# Altium schematic sheet Microphone-Boards_V1.0_SD18OB261.SchDoc: Microphone-Boards
size A4; PageSetup: Record=PageOptions|CenterHorizontal=True|CenterVertical=True|PrintScale=0.97|XCorrection=1.00|YCorrection=1.00|PrintKind=0|BorderSize=5000000|LeftOffset=0|BottomOffset=0|Orientation=2|PaperLength=1000|PaperWidth=1000|Scale=100|PaperSource=7|PrintQuality=-3|MediaType=1|DitherType=10|PrintScaleMode=1|PaperKind=A4|PaperIndex=9; Organization: Ostschweizer Fachhochschule; Address2: Florian Baumgartner & Alain Keller; Address3: florian.baumgartner@ost.ch; DocumentNumber: 1; Revision: V1.0; SheetNumber: 5; SheetTotal: 5; Author: Florian Baumgartner & Alain Keller; Subtitle: SD18OB261-060 (Bottom Port)
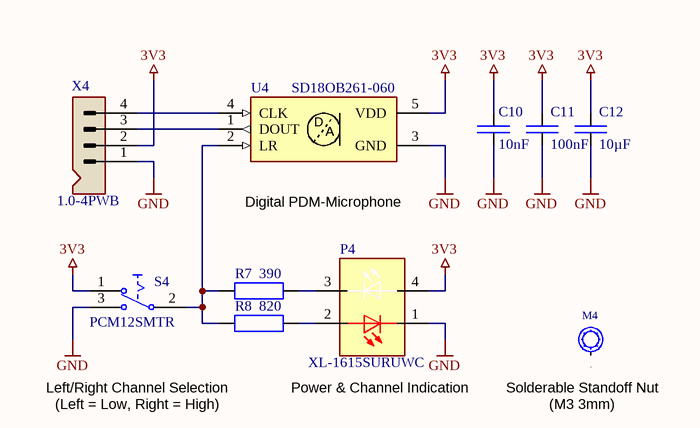
[diagram p0: Microphone-Boards_V1.0_SD18OB261.SchDoc]

## Parts
C10  10nF  [SMD Keramikkondensator 0603]
C11  100nF  [SMD Keramikkondensator 0603]
C12  10µF  [SMD Keramikkondensator 1206]
M4  SMTSO-M3-3ET  [SMD Solder-Nut (M3 3mm)]  (value not drawn)
P4  XL-1615SURUWC  [SMD LED 0606]
R7  390  [SMD Widerstand 0603]
R8  820  [SMD Widerstand 0603]
S4  PCM12SMTR  [SMD Switch SPDT (PCM12SMTR)]
U4  SD18OB261-060  [SMD Microphone (SD18OB261-060)]
X4  1.0-4PWB  [SMD Connector (SM04B-SRSS-TB)]

## Ports
M

## Nets
3V3: C10.2 C11.2 C12.2 P4.4(WA) S4.1(NC1) U4.5(VDD) X4.2
GND: C10.1 C11.1 C12.1 P4.1(RC) S4.3(NO1) U4.3(GND) X4.1
M: M4.1 ; port M
NetP4_2: P4.2(RA) R8.2
NetP4_3: P4.3(WC) R7.2
NetR7_1: R7.1 R8.1 S4.2(COMMON1) U4.2(LR)
NetU4_1: U4.1(DOUT) X4.3
NetU4_4: U4.4(CLK) X4.4

## Notes on the sheet
- (near U4) Digital PDM-Microphone
- Left/Right Channel Selection
- Power & Channel Indication
- (near M4) Solderable Standoff Nut
- (Left = Low, Right = High)
- (near M4) (M3 3mm)
- Title
- Author:
- Subtitle
- Date:
- Rev:
- File:
- Sheet
- of
- (in symbol U-SD18OB261-060) D; A

## Library data of the parts
C10 = C-CAPACITOR: CAP-MK; Component Description: Multilayer Ceramic Capacitors; Component Value: 10nF 50V; Digikey: 445-5662-1-ND; Farnell: 2346966; Mouser: 77-VJ0603V103ZXAPBC; JLC-Parts: C57112; Unit Price: 0.01
C11 = E6 - 100nF: SMD Ceramic Capacitor E6; Component Value: 100nF 50V; Component Description: Multilayer Ceramic Capacitors MLCC; ComponentLink1Description: Datasheet; ComponentLink1URL: https://datasheet.lcsc.com/lcsc/1809301912_YAGEO-CC0603KRX7R9BB104_C14663.pdf; Digikey: 445-6899-1-ND; Farnell: 2210822; JLC-Parts: C14663; Mouser: 810-CGA2B3X7R1H104K; Unit Price: 0.01
C12 = E6 - 10uF: SMD Ceramic Capacitor E6; Component Value: 10µF 50V; Component Description: Multilayer Ceramic Capacitors MLCC; ComponentLink1Description: Datasheet; ComponentLink1URL: https://datasheet.lcsc.com/lcsc/1810191219_Samsung-Electro-Mechanics-CL10A106KP8NNNC_C19702.pdf; Digikey: 587-3258-1-ND; Farnell: 2113070; JLC-Parts: C13585; Mouser: 963-LMK107BBJ106MALT; Unit Price: 0.01
M4 = M-Spacer_M3_3mm: Solderable Standoff Nut; Component Value: M3 3mm; Mouser: 153-SMTSO-M3-3ET; Component Description: Solderable Standoff Nut; Unit Price: 0.05; JLC-Parts: C2915308; ComponentLink1Description: Datasheet; ComponentLink1URL: https://datasheet.lcsc.com/lcsc/2112061830_Sinhoo-SMTSO3030CTJ_C2915308.pdf
P4 = P-XL-1615SURUWC: LED Red/White; ComponentLink1Description: Datasheet; ComponentLink1URL: https://datasheet.lcsc.com/lcsc/2211030000_XINGLIGHT-XL-1615SURUWC_C965837.pdf; JLC-Parts: C965837; Component Description: LED Red/White; Component Value: XL-1615SURUWC; Unit Price: 0.02
R7 = R-RESISTOR: SMD-Widerstand 1/4W; Component Description: Thick Film Chip Resistor; Component Value: 390 (75V, 100mW, 1%); Digikey: P390HCT-ND; Farnell: 2303111; Mouser: 667-ERJ-3EKF3900V; JLC-Parts: C23151; Unit Price: 0.06
R8 = R-RESISTOR: SMD-Widerstand 1/4W; Component Description: Thick Film Chip Resistor; Component Value: 820 (75V, 100mW, 1%); Digikey: P820HCT-ND; Farnell: 2303136; Mouser: 667-ERJ-3EKF8200V; JLC-Parts: C23253; Unit Price: 0.06
S4 = S-PCM12SMTR: Miniature Slide Switch; aliExpress: 33002042977; Component Value: PCM12SMTR (SPDT); Digikey: 401-2016-1-ND; Mouser: 611-PCM12SMTR; Farnell: 9575146; ComponentLink1Description: Datasheet; ComponentLink1URL: https://datasheet.lcsc.com/lcsc/1912111437_SHOU-HAN-MSK12C02_C431540.pdf; JLC-Parts: C431540; Component Description: Miniature Slide Switch; Unit Price: 0.04
U4 = U-SD18OB261-060: Digital PDM MEMS Microphone (Bottom Port); Digikey: 4719-SD18OB261-050DKR-ND; ComponentLink1Description: Datasheet; ComponentLink1URL: https://datasheet.lcsc.com/lcsc/2208241200_Goertek-SD18OB261-060_C2895290.pdf; Component Description: Digital PDM MEMS Microphone (Bottom Port); Component Value: SD18OB261-060; JLC-Parts: C2895290; Unit Price: 0.61
X4 = X-Stiftleiste (4-Fach): Wire To Board Connector (1x4P 1.0mm); Digikey: 455-SM04B-SRSS-TBCT-ND; Farnell: 1830839; Component Description: Wire To Board Connector (1x4P 1.0mm); Component Value: 1.0-4PWB; JLC-Parts: C2905006; Unit Price: 0.03; ComponentLink1Description: Datasheet; ComponentLink1URL: https://datasheet.lcsc.com/lcsc/2111080930_DEALON-1-0-4PWB_C2905006.pdf